# EAGLE design LTC4063-TestBoard_nicht SMD (EAGLE 9.2.0)
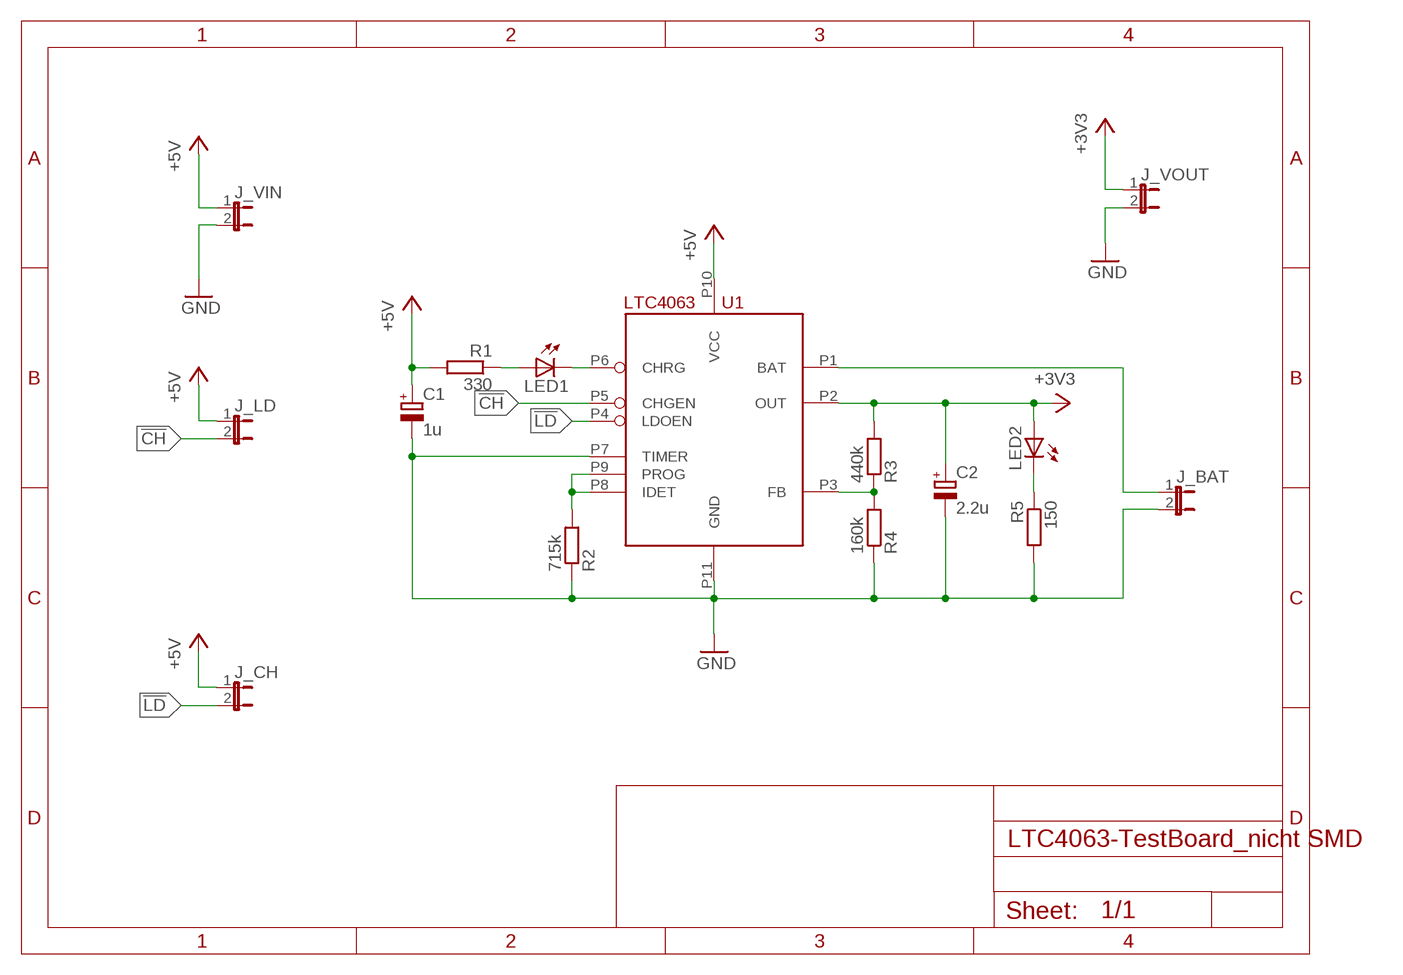
[diagram p0: schematic, sheet 1]

## Parts
C1  1u  CPOL-EUE2.5-6  [E2,5-6]
C2  2.2u  CPOL-EUE2.5-6  [E2,5-6]
J_BAT  JP1E  [JP1]
J_CH  JP1E  [JP1]
J_LD  JP1E  [JP1]
J_VIN  JP1E  [JP1]
J_VOUT  JP1E  [JP1]
LED1  LED3MM  [LED3MM]
LED2  LED3MM  [LED3MM]
R1  330  R-EU_0207/7  [0207/7]
R2  715k  R-EU_0207/7  [0207/7]
R3  440k  R-EU_0207/7  [0207/7]
R4  160k  R-EU_0207/7  [0207/7]
R5  150  R-EU_0207/7  [0207/7]
U1  LTC4063  [LTC4063]

## Nets
!CH: J_LD.2 U1.P5(CHGEN)
!LD: J_CH.2 U1.P4(LDOEN)
+3V3: C2.+ J_VOUT.1 LED2.A R3.2 U1.P2(OUT)
+5V: C1.+ J_CH.1 J_LD.1 J_VIN.1 R1.2 U1.P10(VCC)
GND: C1.- C2.- J_BAT.2 J_VIN.2 J_VOUT.2 R2.1 R4.1 R5.2 U1.P7(TIMER) U1.P11(GND)
N$1: R3.1 R4.2 U1.P3(FB)
N$2: J_BAT.1 U1.P1(BAT)
N$3: LED1.K(C) U1.P6(CHRG)
N$4: LED1.A R1.1
N$5: R2.2 U1.P8(IDET) U1.P9(PROG)
N$6: LED2.K(C) R5.1

## Library data of the parts
C1 C2 = rcl:CPOL-EU: POLARIZED CAPACITOR, European symbol; SPICEPREFIX: C
J_BAT J_CH J_LD J_VIN J_VOUT = jumper:JP1E: JUMPER
LED1 LED2 = led:LED: LED OSRAM: - CHIPLED LG R971, LG N971, LY N971, LG Q971, LY Q971, LO R971, LY R971 LH N974, LH R974 LS Q976, LO Q976, LY Q976 LO Q996 - Hyper CHIPLED LW Q18S LB Q993, LB Q99A, LB R99A - SideLED LS A670, LO A670, LY A670, LG A670, LP A670 LB A673, LV A673, LT A673, LW A673 LH A674 LY A675 LS A676, LA A676, LO A676, LY A676, LW A676 LS A679, LY A679, LG A679 - Hyper Micro SIDELED® LS Y876, LA Y876, LO Y876, LY Y876 LT Y87S - SmartLED LW L88C, LW L88S LB L89C, LB L89S, LG L890 LS L89K, LO L89K, LY L89K LS L896, LA L896, LO L896, LY L896 - TOPLED LS T670, LO T670, LY T670, LG T670, LP T670 LSG T670, LSP T670, LSY T670, LOP T670, LYG T670 LG T671, LOG T671, LSG T671 LB T673, LV T673, LT T673, LW T673 LH T674 LS T676, LA T676, LO T676, LY T676, LB T676, LH T676, LSB T676, LW T676 LB T67C, LV T67C, LT T67C, LS T67K, LO T67K, LY T67K, LW E67C LS E67B, LA E67B, LO E67B, LY E67B, LB E67C, LV E67C, LT E67C LW T67C LS T679, LY T679, LG T679 LS T770, LO T770, LY T770, LG T770, LP T770 LB T773, LV T773, LT T773, LW T773 LH T774 LS E675, LA E675, LY E675, LS T675 LS T776, LA T776, LO T776, LY T776, LB T776 LHGB T686 LT T68C, LB T68C - Hyper Mini TOPLED® LB M676 - Mini TOPLED Santana® LG M470 LS M47K, LO M47K, LY M47K Source: http://www.osram.convergy.de LUXEON: - LUMILED® LXK2-PW12-R00, LXK2-PW12-S00, LXK2-PW14-U00, LXK2-PW14-V00 LXK2-PM12-R00, LXK2-PM12-S00, LXK2-PM14-U00 LXK2-PE12-Q00, LXK2-PE12-R00, LXK2-PE12-S00, LXK2-PE14-T00, LXK2-PE14-U00 LXK2-PB12-K00, LXK2-PB12-L00, LXK2-PB12-M00, LXK2-PB14-N00, LXK2-PB14-P00, LXK2-PB14-Q00 LXK2-PR12-L00, LXK2-PR12-M00, LXK2-PR14-Q00, LXK2-PR14-R00 LXK2-PD12-Q00, LXK2-PD12-R00, LXK2-PD12-S00 LXK2-PH12-R00, LXK2-PH12-S00 LXK2-PL12-P00, LXK2-PL12-Q00, LXK2-PL12-R00 Source: www.luxeon.com KINGBRIGHT: KA-3528ASYC Source: www.kingbright.com
R1-R5 = rcl:R-EU_: RESISTOR, European symbol; SPICEPREFIX: R
U1 = LinearTechnology:LTC4063: LTC4063 - Standalone Linear Li-Ion Charger with Micropower Low Dropout Linear Regulator The LTC®4063 is a standalone linear charger for single cell lithium-ion batteries with an adjustable low dropout linear regulator (LDO). The adjustable LDO regulates an output voltage between 1.2V to 4.2V at up to 100mA load cur- rent. When the input supply (wall adapter or USB supply) is removed, the LDO regulates the output voltage without interruption. The battery charger and LDO regulator can be enabled individually. No external sense resistor or external blocking diode is required for charging due to the internal MOSFET archi- tecture. For more details have a look at the data sheet <http://cds.linear.com/docs/en/datasheet/4063fc.pdf>. Copyright (c) 2013, Michael Hohl <http://www.michaelhohl.net>

## Board
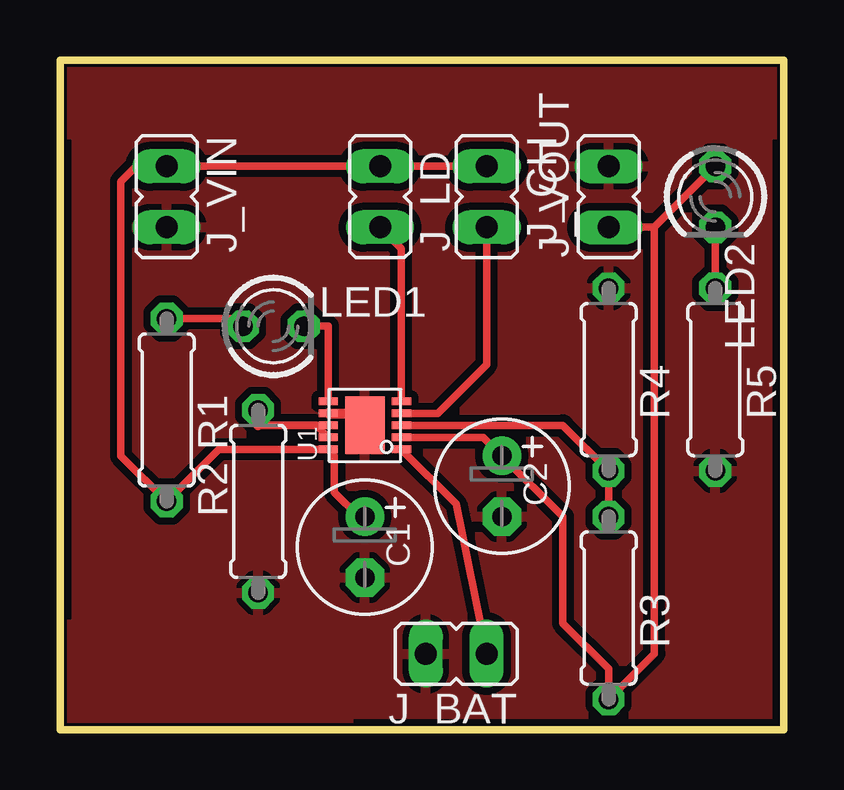
[diagram p1: board, top side]

Size 30.15 x 27.93 mm. Coordinates in mm from the lower left corner, seen from the top.
Outline: 0,0 30.15,0 30.15,27.93 0,27.93 0,0
Copper layers (1*16): Top 0.035mm / dielectric 1.5mm / Bottom 0.035mm
Design rules "default *": minimum track width 10mil, minimum drill 24mil, track to track 8mil, track to pad 8mil, pad to pad 8mil, via to via 8mil, smd to smd 8mil, copper to edge 5mil, drill to drill 8mil, minimum pad ring 10mil, minimum via ring 8mil, stop-mask expansion 4mil, vias tented up to drill 0mil, thermal gap 10mil

### Footprints (pad centres in the part's own frame; a part is rotated, then mirrored left to right if it is on the bottom)
E2,5-6 = drill 0.813 pad 1.6: + -1.27,0 | drill 0.813 pad 1.6 octagon: - 1.27,0
JP1 = drill 0.914 long: 1 0,-1.27; 2 0,1.27
LED3MM = drill 0.813 octagon: A -1.27,0; K 1.27,0
0207/7 = drill 0.813 octagon: 1 -3.81,0; 2 3.81,0
LTC4063 = smd 0.3 x 0.8: P1 -1,-1.525; P2 -0.5,-1.525; P3 0,-1.525; P4 0.5,-1.525; P5 1,-1.525; P6 1,1.525; P7 0.5,1.525; P8 0,1.525; P9 -0.5,1.525; P10 -1,1.525 | smd 2.38 x 1.65: P11 0,0

### Placement (x,y rotation side)
C1  12.7,7.62 270 top
C2  18.41,10.16 270 top
J_BAT  16.51,3.17 90 top
J_CH  17.78,22.23 180 top
J_LD  13.34,22.23 180 top
J_VIN  4.45,22.23 180 top
J_VOUT  22.86,22.23 0 top
LED1  8.89,16.83 0 top
LED2  27.3,22.23 270 top
R1  4.45,13.34 270 top
R2  8.26,9.53 90 top
R3  22.86,5.08 270 top
R4  22.86,14.61 270 top
R5  27.3,14.61 270 top
U1  12.7,12.7 90 top

### Tracks (layer width: path | path; a pad name or v marks a point on that pad's centre or on a via)
!CH
  Top 0.305: U1.P5 14.22,20.07 J_LD.2
!LD
  Top 0.305: U1.P4 15.74,13.2 17.78,15.24 J_CH.2
+3V3
  Top 0.305: J_VOUT.1 24.77,20.95 | 24.77,20.95 LED2.A | U1.P2 17.64,12.2 C2.+ 20.95,8.89 20.95,4.45 22.86,2.54 R3.2 24.77,3.17 24.77,20.95
+5V
  Top 0.305: J_CH.1 J_LD.1 J_VIN.1 3.17,23.5 2.54,22.86 2.54,11.43 R1.2 6.62,11.7 U1.P10 11.43,11.45 11.43,9.91 12.45,8.89 C1.+
GND
  Top 0.406: U1.P7 12.7,13.2 U1.P11
  pour Top (isolate 0.305): 0,0 0,27.94 29.84,27.94 29.84,0
N$1
  Top 0.305: R3.1 R4.2 20.95,12.7 U1.P3
N$2
  Top 0.305: U1.P1 16.51,9.41 J_BAT.1
N$3
  Top 0.305: U1.P6 11.18,16.83 LED1.K
N$4
  Top 0.305: R1.1 7.62,17.14 LED1.A
N$5
  Top 0.305: U1.P8 8.26,12.7 | U1.P9 10.67,12.71 8.26,12.71
  Top 0.406: 8.26,12.7 R2.2 8.26,12.71
N$6
  Top 0.305: LED2.K R5.1
N$7
  pour Top: 0,27.94 29.84,27.94 29.84,24.77 0,24.77
N$8
  pour Top: 0,4.45 12.06,4.45 12.06,0 0,0

### Text on the board
tRestrict: IN | OUT | LDO | CHG | LTC4063